# Altium schematic sheet PiPico.SchDoc
size B; SheetNumber: 5; SheetTotal: 5
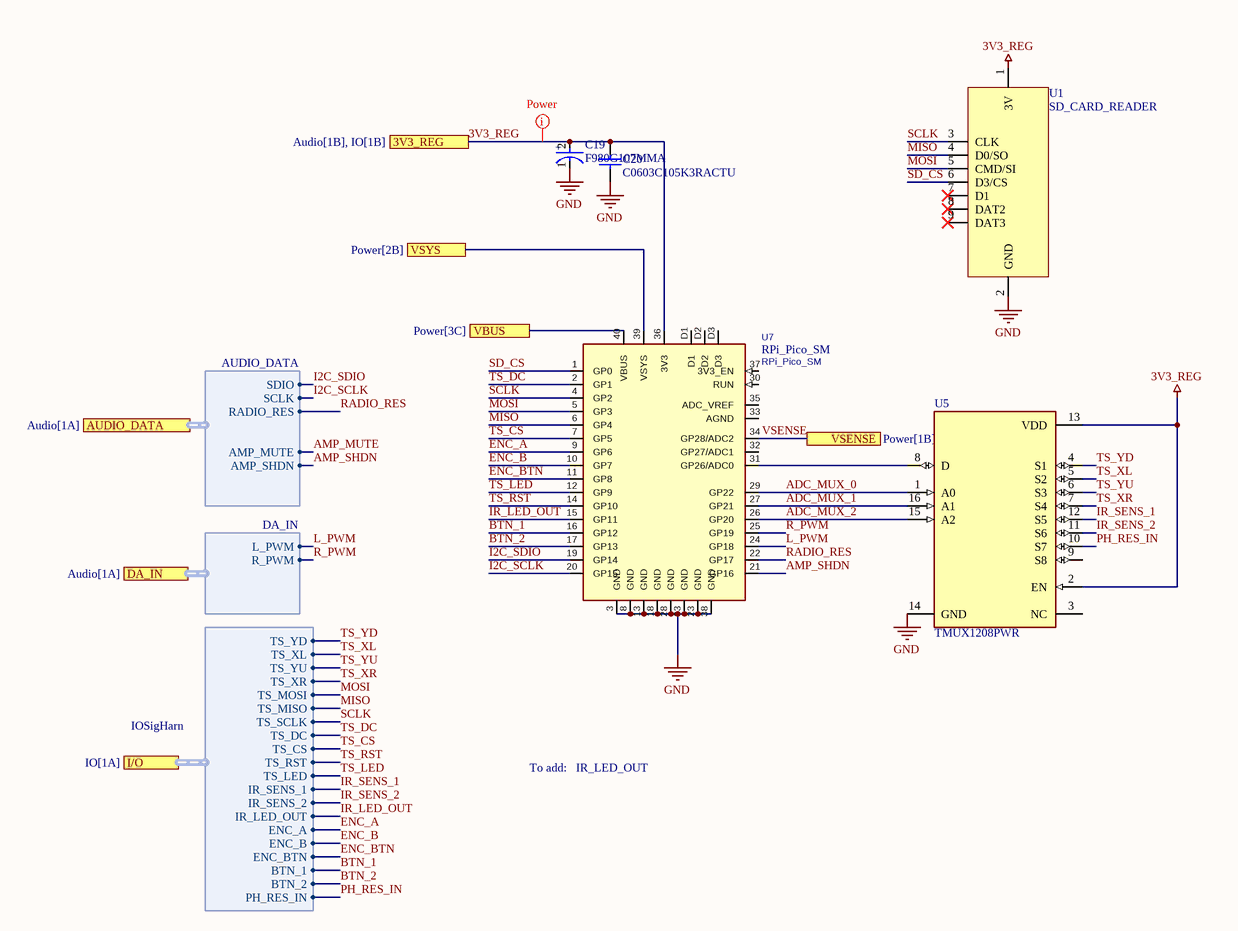
[diagram p0: PiPico.SchDoc]

## Parts
C19  F980G107MMA  [FP-F98M-MFG]
C20  C0603C105K3RACTU  [CAPC1608X87X35LL15T15]
U1  SD_CARD_READER  [6-pin Header (Generic)]
U5  TMUX1208PWR  [FP-PW0016A-IPC_A]
U7  RPi_Pico_SM  [RPi_Pico_SM]

## Ports
3V3_REG (see Audio[1B], IO[1B]), AUDIO_DATA (harness AUDIO_DATA, see Audio[1A]), DA_IN (harness DA_IN, see Audio[1A]), I/O (harness IOSigHarn, see IO[1A]), VBUS (see Power[3C]), VSENSE (see Power[1B]), VSYS (see Power[2B])

## Harnesses
AUDIO_DATA: SDIO, SCLK, AMP_MUTE, AMP_SHDN, RADIO_RES
DA_IN: L_PWM, R_PWM
IOSigHarn: TS_YD, TS_XL, TS_YU, TS_XR, TS_MOSI, TS_MISO, TS_SCLK, TS_DC, TS_CS, TS_RST, TS_LED, IR_SENS_1, IR_SENS_2, IR_LED_OUT, ENC_A, ENC_B, ENC_BTN, BTN_1, BTN_2, PH_RES_IN

## Nets
3V3_REG: C19.2(A) C20.2 U1.1(3V) U5.2(EN) U5.13(VDD) U7.36(3V3) ; port 3V3_REG
GND: C19.1(C) C20.1 U1.2(GND) U5.14(GND) U7.3(GND) U7.8(GND) U7.13(GND) U7.18(GND) U7.23(GND) U7.28(GND) U7.33(AGND) U7.38(GND)
ADC_MUX_0: U5.1(A0) U7.29(GP22)
ADC_MUX_1: U5.16(A1) U7.27(GP21)
ADC_MUX_2: U5.15(A2) U7.26(GP20)
AMP_MUTE: port AUDIO_DATA.AMP_MUTE
AMP_SHDN: U7.21(GP16) ; port AUDIO_DATA.AMP_SHDN
BTN_1: U7.16(GP12) ; port I/O.BTN_1
BTN_2: U7.17(GP13) ; port I/O.BTN_2
ENC_A: U7.9(GP6) ; port I/O.ENC_A
ENC_B: U7.10(GP7) ; port I/O.ENC_B
ENC_BTN: U7.11(GP8) ; port I/O.ENC_BTN
I2C_SCLK: U7.20(GP15) ; port AUDIO_DATA.SCLK
I2C_SDIO: U7.19(GP14) ; port AUDIO_DATA.SDIO
IR_LED_OUT: U7.15(GP11) ; port I/O.IR_LED_OUT
IR_SENS_1: U5.12(S5) ; port I/O.IR_SENS_1
IR_SENS_2: U5.11(S6) ; port I/O.IR_SENS_2
L_PWM: U7.24(GP18) ; port DA_IN.L_PWM
MISO: U1.4(D0/SO) U7.6(GP4) ; port I/O.TS_MISO
MOSI: U1.5(CMD/SI) U7.5(GP3) ; port I/O.TS_MOSI
PH_RES_IN: U5.10(S7) ; port I/O.PH_RES_IN
R_PWM: U7.25(GP19) ; port DA_IN.R_PWM
RADIO_RES: U7.22(GP17) ; port AUDIO_DATA.RADIO_RES
SCLK: U1.3(CLK) U7.4(GP2) ; port I/O.TS_SCLK
SD_CS: U1.6(D3/CS) U7.1(GP0)
TS_CS: U7.7(GP5) ; port I/O.TS_CS
TS_DC: U7.2(GP1) ; port I/O.TS_DC
TS_LED: U7.12(GP9) ; port I/O.TS_LED
TS_RST: U7.14(GP10) ; port I/O.TS_RST
TS_XL: U5.5(S2) ; port I/O.TS_XL
TS_XR: U5.7(S4) ; port I/O.TS_XR
TS_YD: U5.4(S1) ; port I/O.TS_YD
TS_YU: U5.6(S3) ; port I/O.TS_YU
VBUS: U7.40(VBUS) ; port VBUS
VSENSE: U7.34(GP28/ADC2) ; port VSENSE
VSYS: U7.39(VSYS) ; port VSYS
NetU5_8: U5.8(D) U7.31(GP26/ADC0)

Not connected (* = marked no-connect by the designer): U1 7(D1)* 8(DAT2)* 9(DAT3)*; U5 3(NC) 9(S8); U7 30(RUN) 32(GP27/ADC1) 35(ADC_VREF) 37(3V3_EN) D1 D2 D3

## Layout directives
net class POWER: 3V3_REG

## Notes on the sheet
- To add:   IR_LED_OUT
- (in symbol CMP-04424-000012-1) +

## Library data of the parts
C19 = CMP-04424-000012-1: CAP TANT 100UF 20% 4V 0603; Manufacturer: AVX Corporation; Life: 1000Hours; Ripple Current: 50mA; Esr: 10Ω; Leakage Current: 80uA; Temperature Coefficient: 30%; Material: Tantalum; Dissipation Factor: 60%; Device Class L1: Passive Components; ComponentLink2Description: Datasheet; Temperature Range High: +125°C; Octopart: https://octopart.com/f980g107mma-avx-28870482; Capacitance: 100uF; Digikey Description: CAP TANT 100UF 20% 4V 0603; Lead Free: Yes; Device Class L3: Tantalum Capacitors; Package: F98M; Temperature: -55°C to +125°C; Automotive: No; Footprint Url: http://www.avx.com/download/software/literature/AVX-Footprint-Library.pdf; Manufacturer Part Number: F980G107MMA; Tolerance: 20%; Value: 100uF; Category: Cap; Device Class L2: Capacitors; ComponentLink2URL: http://datasheets.avx.com/F98.pdf; Voltage Rating: 4V; Temperature Range Low: -55°C; Height: 0.9mm; RoHS: TRUE
C20 = CMP-2006-03713-1: Manufacturer: Kemet; Part Number: C0603C105K3RACTU
U5 = CMP-04892-000035-1: IC SWITCH SINGLE 16TSSOP; RoHS Compliant: Yes
U7 = RPi_Pico_SM: ki_keywords: Raspberry Pi Pico; Value: RPi_Pico_SM; Footprint: ECE:RPi_Pico_SM; ki_description: Raspberry Pi Pico